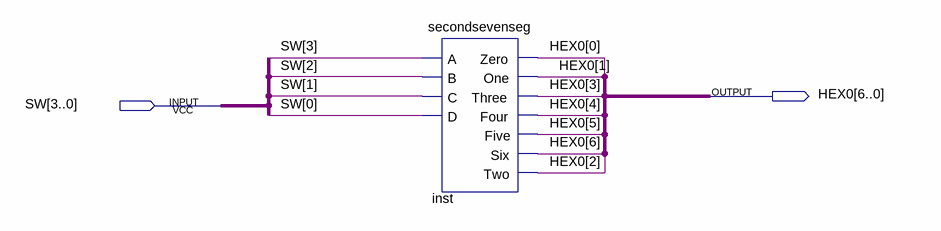
[diagram p0: schematic sheet]
// Quartus schematic final.bdf as structural Verilog: 1 symbols, 2 pins
module \final  (
  input  [3:0] SW,
  output [6:0] HEX0
);

  secondsevenseg inst (
    .A(SW[3]), .B(SW[2]), .C(SW[1]), .D(SW[0]), .Zero(HEX0[0]), .One(HEX0[1]), .Three(HEX0[3]),
    .Four(HEX0[4]), .Five(HEX0[5]), .Six(HEX0[6]), .Two(HEX0[2]));
endmodule
